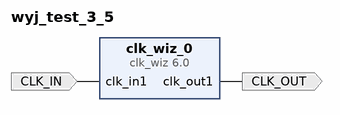
[diagram p0: block diagram of the top level]
# Vivado block design wyj_test_3_5, xc7a35tcsg324-1, Vivado 2024.2
create_bd_design wyj_test_3_5

create_bd_port -dir I CLK_IN
create_bd_port -dir O CLK_OUT

create_bd_cell -type ip -vlnv xilinx.com:ip:clk_wiz:6.0 clk_wiz_0
set_property -dict [list \
  CONFIG.CLKOUT1_JITTER 326.140 \
  CONFIG.CLKOUT1_PHASE_ERROR 137.956 \
  CONFIG.CLKOUT1_REQUESTED_OUT_FREQ 6.25 \
  CONFIG.MMCM_CLKFBOUT_MULT_F 15.125 \
  CONFIG.MMCM_CLKOUT0_DIVIDE_F 121.000 \
  CONFIG.MMCM_DIVCLK_DIVIDE 2 \
] [get_bd_cells clk_wiz_0]

# ---- connections ----

connect_bd_net [get_bd_ports CLK_IN] [get_bd_pins clk_wiz_0/clk_in1]
connect_bd_net [get_bd_pins clk_wiz_0/clk_out1] [get_bd_ports CLK_OUT]

validate_bd_design
save_bd_design
